# EAGLE design main (EAGLE 9.3.0)
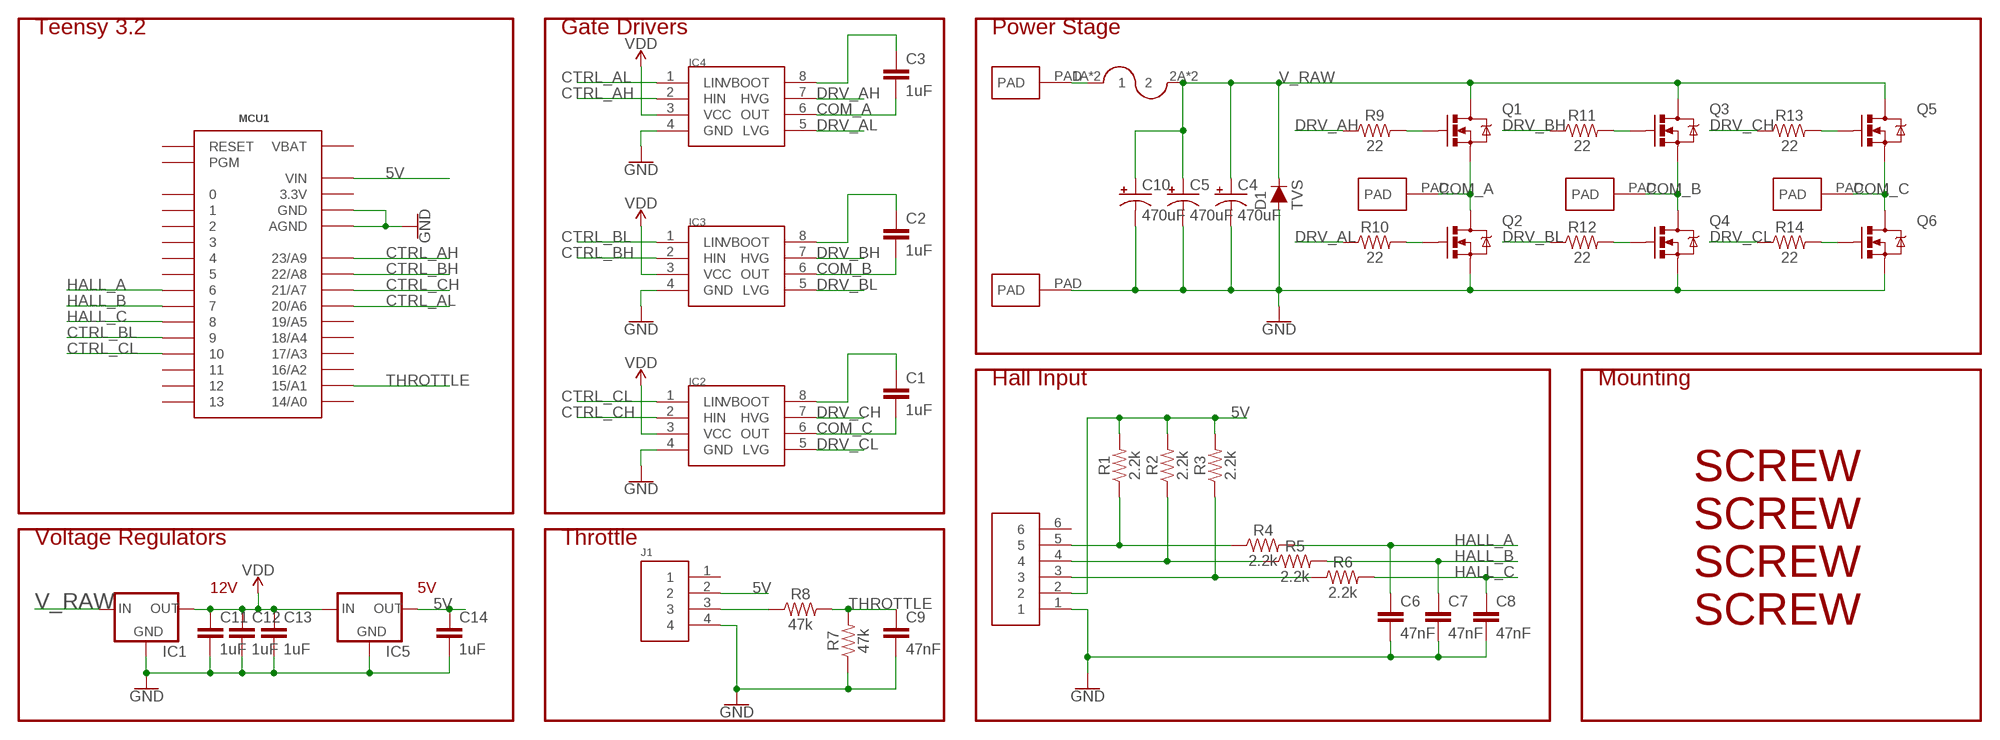
[diagram p0: schematic, sheet 1]

## Parts
C1  1uF  0.1UF-KIT-EZ-50V-20%  [CAP-PTH-SMALL-KIT]
C2  1uF  0.1UF-KIT-EZ-50V-20%  [CAP-PTH-SMALL-KIT]
C3  1uF  0.1UF-KIT-EZ-50V-20%  [CAP-PTH-SMALL-KIT]
C4  470uF  1000UF-RADIAL-5MM-25V-20%  [CPOL-RADIAL-5MM-10MM]
C5  470uF  1000UF-RADIAL-5MM-25V-20%  [CPOL-RADIAL-5MM-10MM]
C6  47nF  0.1UF-KIT-EZ-50V-20%  [CAP-PTH-SMALL-KIT]
C7  47nF  0.1UF-KIT-EZ-50V-20%  [CAP-PTH-SMALL-KIT]
C8  47nF  0.1UF-KIT-EZ-50V-20%  [CAP-PTH-SMALL-KIT]
C9  47nF  0.1UF-KIT-EZ-50V-20%  [CAP-PTH-SMALL-KIT]
C10  470uF  1000UF-RADIAL-5MM-25V-20%  [CPOL-RADIAL-5MM-10MM]
C11  1uF  0.1UF-KIT-EZ-50V-20%  [CAP-PTH-SMALL-KIT]
C12  1uF  0.1UF-KIT-EZ-50V-20%  [CAP-PTH-SMALL-KIT]
C13  1uF  0.1UF-KIT-EZ-50V-20%  [CAP-PTH-SMALL-KIT]
C14  1uF  0.1UF-KIT-EZ-50V-20%  [CAP-PTH-SMALL-KIT]
D1  TVS  DIODE-PTH  [DIODE-1N4001]
IC1  V_REG_78XX  [V78W_BACKWARDS]
IC2  L6387EDIP8  [DIP762W53P254L1092H508Q8B]
IC3  L6387EDIP8  [DIP762W53P254L1092H508Q8B]
IC4  L6387EDIP8  [DIP762W53P254L1092H508Q8B]
IC5  V_REG_78XXTO-92_UNTESTED  [TO-92]
J1  HEADER4VALULOK  [4PINVALULOK]
J2  HEADER6  [6PINVALULOK]
J3  FUSE  [AUTO_FUSE]
MCU1  TEENSY_3.0_BASIC  [TEENSY_3.0_BASIC]
Q1  MOSFET-NCHANNELTO-220-FLAT  [TO-220-FLAT]
Q2  MOSFET-NCHANNELTO-220-FLAT  [TO-220-FLAT]
Q3  MOSFET-NCHANNELTO-220-FLAT  [TO-220-FLAT]
Q4  MOSFET-NCHANNELTO-220-FLAT  [TO-220-FLAT]
Q5  MOSFET-NCHANNELTO-220-FLAT  [TO-220-FLAT]
Q6  MOSFET-NCHANNELTO-220-FLAT  [TO-220-FLAT]
R1  2.2k  RESISTORAXIAL-0.3  [AXIAL-0.3]
R2  2.2k  RESISTORAXIAL-0.3  [AXIAL-0.3]
R3  2.2k  RESISTORAXIAL-0.3  [AXIAL-0.3]
R4  2.2k  RESISTORAXIAL-0.3  [AXIAL-0.3]
R5  2.2k  RESISTORAXIAL-0.3  [AXIAL-0.3]
R6  2.2k  RESISTORAXIAL-0.3  [AXIAL-0.3]
R7  47k  RESISTORAXIAL-0.3  [AXIAL-0.3]
R8  47k  RESISTORAXIAL-0.3  [AXIAL-0.3]
R9  22  RESISTORAXIAL-0.3  [AXIAL-0.3]
R10  22  RESISTORAXIAL-0.3  [AXIAL-0.3]
R11  22  RESISTORAXIAL-0.3  [AXIAL-0.3]
R12  22  RESISTORAXIAL-0.3  [AXIAL-0.3]
R13  22  RESISTORAXIAL-0.3  [AXIAL-0.3]
R14  22  RESISTORAXIAL-0.3  [AXIAL-0.3]
U$4  PAD  [PAD]
U$5  PAD  [PAD]
U$6  PAD  [PAD]
U$7  PAD  [PAD]
U$8  PAD  [PAD]
U$10  SCREW  [M3HOLE]
U$11  SCREW  [M3HOLE]
U$12  SCREW  [M3HOLE]
U$13  SCREW  [M3HOLE]

## Nets
5V: C14.1 IC5.1(OUT) J1.2 J2.2 MCU1.VIN R1.P$2 R2.P$2 R3.P$2
COM_A: C3.2 IC4.6(OUT) Q1.3(S) Q2.2(D) Q2.PAD(D) U$6.PAD
COM_B: C2.2 IC3.6(OUT) Q3.3(S) Q4.2(D) Q4.PAD(D) U$7.PAD
COM_C: C1.2 IC2.6(OUT) Q5.3(S) Q6.2(D) Q6.PAD(D) U$8.PAD
CTRL_AH: IC4.2(HIN) MCU1.23/A9
CTRL_AL: IC4.1(LIN) MCU1.20/A6
CTRL_BH: IC3.2(HIN) MCU1.22/A8
CTRL_BL: IC3.1(LIN) MCU1.9
CTRL_CH: IC2.2(HIN) MCU1.21/A7
CTRL_CL: IC2.1(LIN) MCU1.10
DRV_AH: IC4.7(HVG) R9.P$1
DRV_AL: IC4.5(LVG) R10.P$1
DRV_BH: IC3.7(HVG) R11.P$1
DRV_BL: IC3.5(LVG) R12.P$1
DRV_CH: IC2.7(HVG) R13.P$1
DRV_CL: IC2.5(LVG) R14.P$1
GND: C4.- C5.- C6.2 C7.2 C8.2 C9.2 C10.- C11.2 C12.2 C13.2 C14.2 D1.A IC1.GND IC2.4(GND) IC3.4(GND) IC4.4(GND) IC5.2(GND) J1.4 J2.1 MCU1.AGND MCU1.GND MCU1.GND1(GND) Q2.3(S) Q4.3(S) Q6.3(S) R7.P$1 U$5.PAD
HALL_A: C6.1 MCU1.6 R4.P$2
HALL_B: C7.1 MCU1.7 R5.P$2
HALL_C: C8.1 MCU1.8 R6.P$2
N$1: C1.1 IC2.8(VBOOT)
N$2: J2.3 R3.P$1 R6.P$1
N$3: C2.1 IC3.8(VBOOT)
N$4: J2.4 R2.P$1 R5.P$1
N$5: C3.1 IC4.8(VBOOT)
N$6: J2.5 R1.P$1 R4.P$1
N$7: J1.3 R8.P$1
N$9: Q1.1(G) R9.P$2
N$10: Q2.1(G) R10.P$2
N$11: Q3.1(G) R11.P$2
N$12: Q4.1(G) R12.P$2
N$13: Q5.1(G) R13.P$2
N$14: Q6.1(G) R14.P$2
THROTTLE: C9.1 MCU1.15/A1 R7.P$2 R8.P$2
V_PREFUSE: J3.1A J3.1B U$4.PAD
V_RAW: C4.+ C5.+ C10.+ D1.C IC1.IN J3.2A J3.2B Q1.2(D) Q1.PAD(D) Q3.2(D) Q3.PAD(D) Q5.2(D) Q5.PAD(D)
VDD: C11.1 C12.1 C13.1 IC1.OUT IC2.3(VCC) IC3.3(VCC) IC4.3(VCC) IC5.3(IN)
Unconnected: J1.1 J2.6 MCU1.0 MCU1.1 MCU1.2 MCU1.3 MCU1.4 MCU1.5 MCU1.11 MCU1.12 MCU1.13 MCU1.14/A0 MCU1.16/A2 MCU1.17/A3 MCU1.18/A4 MCU1.19/A5 MCU1.PGM MCU1.RESET

## Notes on the sheet
- Teensy 3.2 | Gate Drivers | Power Stage
- Hall Input | Mounting
- Voltage Regulators | Throttle
- 12V | 5V

## Power pins joined to a net without a drawn wire
3.3V: MCU1.3.3V MCU1.3.3V1(3.3V)
VBAT: MCU1.VBAT

## Library data of the parts
C1-C3 C6-C9 C11-C14 = SparkFun-Capacitors:0.1UF: 0.1µF ceramic capacitors A capacitor is a passive two-terminal electrical component used to store electrical energy temporarily in an electric field.; PROD_ID: CAP-08370; VALUE: 0.1uF
C4 C5 C10 = SparkFun-Capacitors:1000UF: 1,000µF/1mF ceramic capacitors A capacitor is a passive two-terminal electrical component used to store electrical energy temporarily in an electric field. CAP-08070; PROD_ID: CAP-09538; VALUE: 1mF
D1 = SparkFun-DiscreteSemi:DIODE: Diode These are standard reverse protection diodes and small signal diodes. SparkFun Products: SparkFun SparkPunk Sound Kit <https://www.sparkfun.com/products/11177> SparkFun ESP8266 Thing <https://www.sparkfun.com/products/13231>; PROD_ID: DIO-09176; VALUE: 1A/50V/1.1V
IC1 = 2018:V_REG_78XX: Voltage Regulator Standard 7805 5V regulator. IGO (Input Ground Output). Spark Fun Electronics SKU : COM-00107
IC2-IC4 = Custom_old:L6387E
IC5 = SparkFun-IC-Power:V_REG_78XX: Voltage Regulator Standard 78xx regulator. IGO (Input Ground Output). Spark Fun Electronics SKU : COM-00107
J1 = Custom_old:HEADER4
J2 = Custom_old:HEADER6
J3 = Custom_old:FUSE
MCU1 = Teensy3.0:TEENSY_3.0_BASIC: Basic Teensy 3.0 with none of the 'inner' pins enabled. See '+4', 'AllAnalogPins", and 'AllPins' packages for additional pin holes, as needed.
Q1-Q6 = Custom_old:MOSFET-NCHANNEL: Generic NMOS footprint
R1-R14 = SparkFun-Resistors:RESISTOR: Generic Resistor Package
U$4-U$8 = Custom_old:PAD
U$10-U$13 = Custom_old:SCREW

## Board
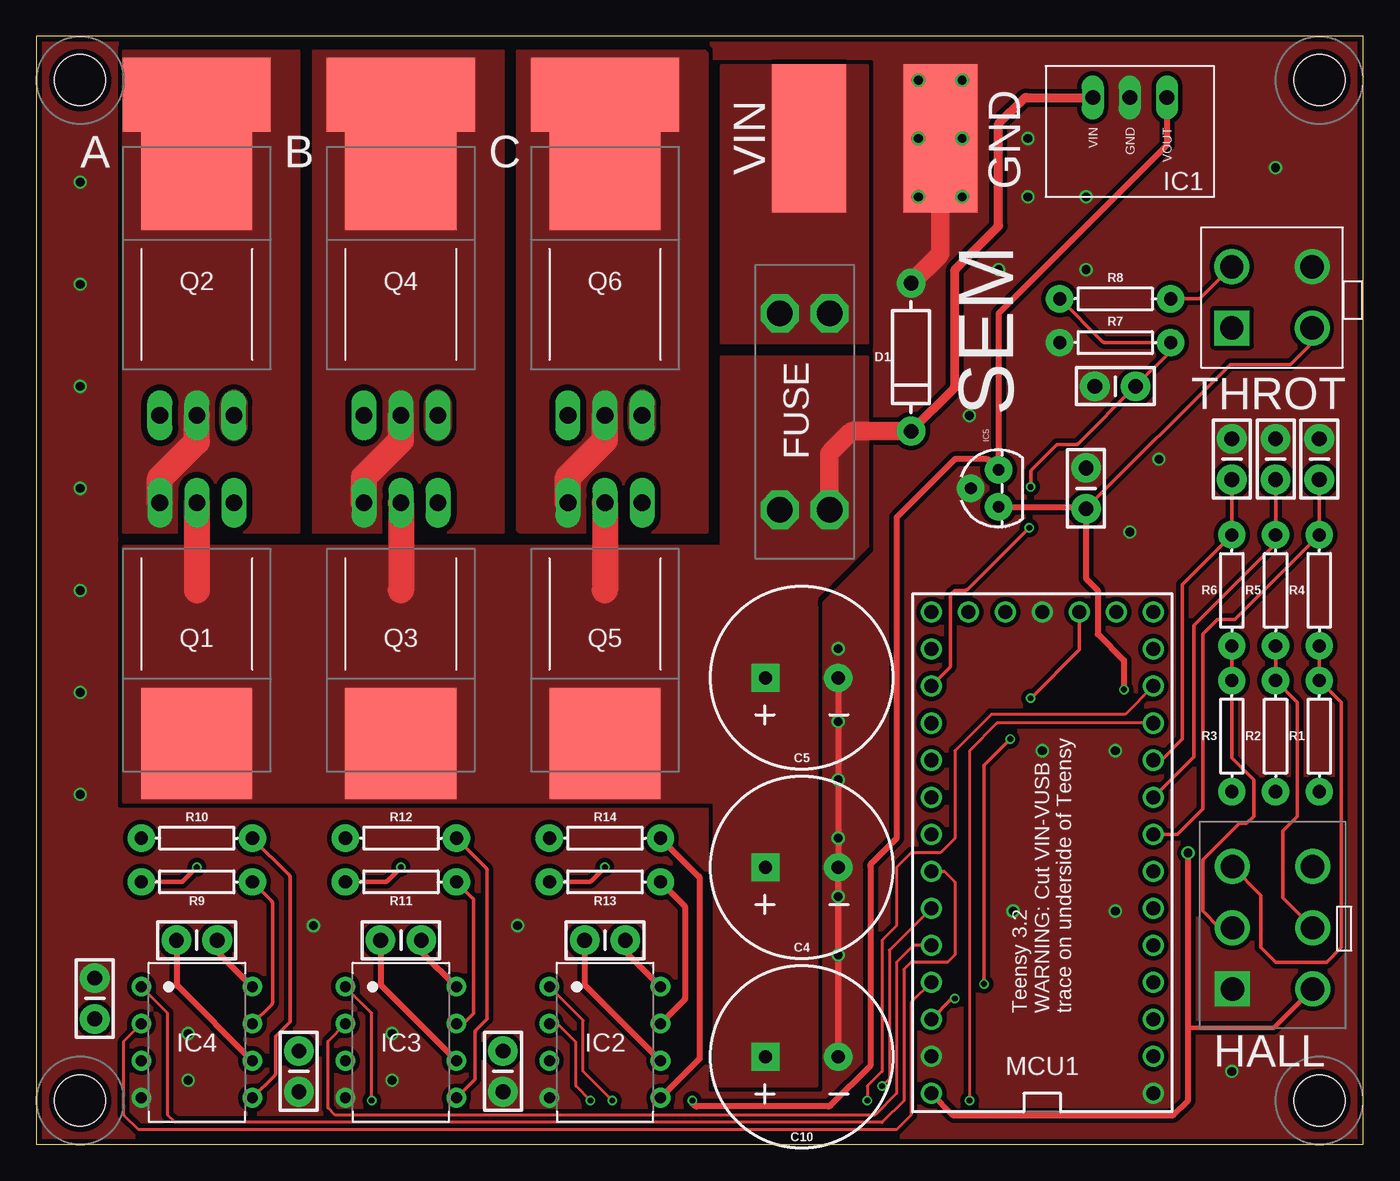
[diagram p1: board, top side]
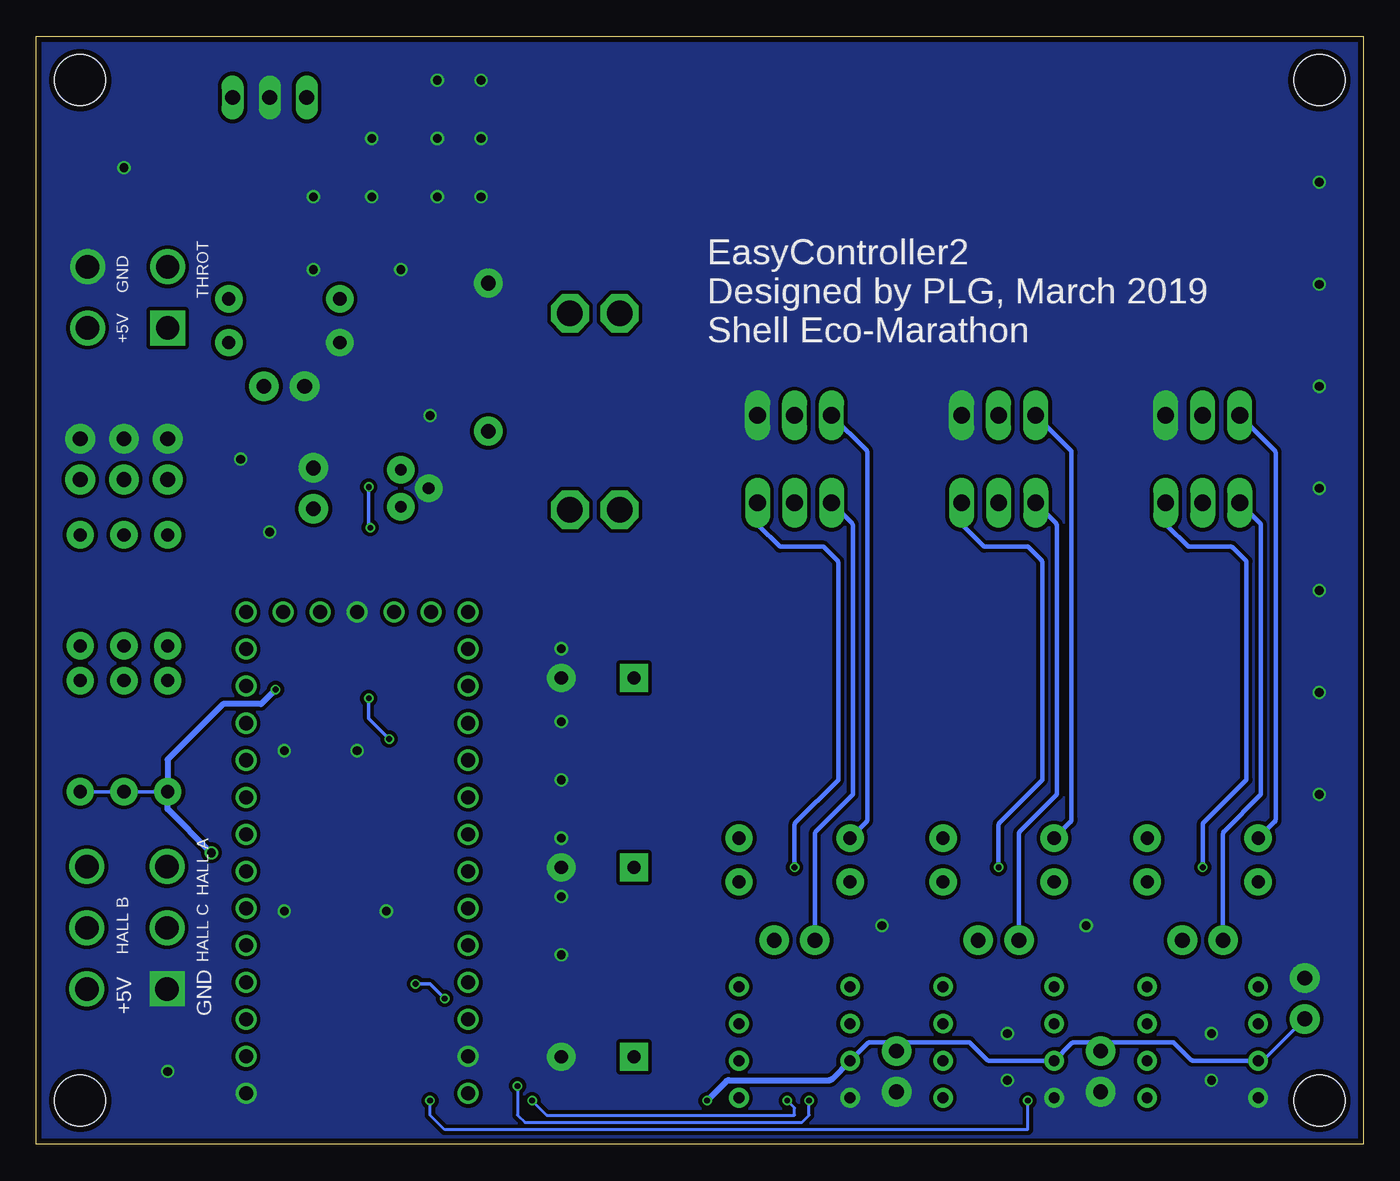
[diagram p2: board, bottom side, seen from below]

Size 91 x 76 mm. Coordinates in mm from the lower left corner, seen from the top.
Outline: 0,0 91,0 91,76 0,76 0,0
Copper layers (1*16): Top 0.035559375mm / dielectric 1.6mm / Bottom 0.035559375mm
Design rules "PATRICK-2lyr *": minimum track width 6mil, minimum drill 10mil, track to track 6mil, track to pad 6mil, pad to pad 6mil, via to via 6mil, smd to smd 6mil, copper to edge 15mil, drill to drill 6mil, minimum pad ring 5mil, minimum via ring 5mil, stop-mask expansion 2.5mil, vias tented up to drill 25mil, thermal gap 10mil

### Footprints (pad centres in the part's own frame; a part is rotated, then mirrored left to right if it is on the bottom)
CAP-PTH-SMALL-KIT = drill 1.016 pad 2.032: 1 -1.397,0; 2 1.397,0
CPOL-RADIAL-5MM-10MM = drill 0.9 pad 1.93 square: + 2.5,0 | drill 0.9 pad 1.93: - -2.5,0
DIODE-1N4001 = drill 1 pad 1.981: A -5.08,0; C 5.08,0
V78W_BACKWARDS = drill 1.016 long: GND 0,-3.81; IN 2.54,-3.81; OUT -2.54,-3.81
DIP762W53P254L1092H508Q8B = drill 0.743 pad 1.343: 1 -3.81,3.81; 2 -3.81,1.27; 3 -3.81,-1.27; 4 -3.81,-3.81; 5 3.81,-3.81; 6 3.81,-1.27; 7 3.81,1.27; 8 3.81,3.81
TO-92 = drill 0.813 pad 1.88: 1 -1.27,0; 2 0,1.905; 3 1.27,0
4PINVALULOK = drill 1.6 square: 1 0,5.5 | drill 1.6: 2 0,0; 3 4.2,5.5; 4 4.2,0
6PINVALULOK = drill 1.6 square: 1 -6.35,2.96 | drill 1.6: 2 -6.35,-2.54; 3 -2.15,2.96; 4 -2.15,-2.54; 5 2.05,2.96; 6 2.05,-2.54
AUTO_FUSE = drill 1.75 octagon: 1A 0,3.4; 1B 0,0; 2A 13.47,3.4; 2B 13.47,0
TEENSY_3.0_BASIC = drill 0.965: 0 -7.62,13.97; 1 -7.62,11.43; 2 -7.62,8.89; 3 -7.62,6.35; 3.3V 7.62,11.43; 3.3V1 -2.54,-16.51; 4 -7.62,3.81; 5 -7.62,1.27; 6 -7.62,-1.27; 7 -7.62,-3.81; 8 -7.62,-6.35; 9 -7.62,-8.89; 10 -7.62,-11.43; 11 -7.62,-13.97; 12 -7.62,-16.51; 13 7.62,-16.51; 14/A0 7.62,-13.97; 15/A1 7.62,-11.43; 16/A2 7.62,-8.89; 17/A3 7.62,-6.35; 18/A4 7.62,-3.81; 19/A5 7.62,-1.27; 20/A6 7.62,1.27; 21/A7 7.62,3.81; 22/A8 7.62,6.35; 23/A9 7.62,8.89; AGND 7.62,13.97; GND -7.62,16.51; GND1 0,-16.51; PGM 2.54,-16.51; RESET 5.08,-16.51; VBAT -5.08,-16.51; VIN 7.62,16.51
TO-220-FLAT = drill 1.143 long: 1 -2.54,0; 2 0,0; 3 2.54,0 | smd 7.62 x 7.62: PAD 0,16.51
AXIAL-0.3 = drill 0.9 pad 1.88: P$1 -3.81,0; P$2 3.81,0
PAD = smd 10.16 x 5.08: PAD 0,0
M3HOLE = hole 3.5: 0,0

### Placement (x,y rotation side)
C1  39,14 180 top
C2  25,14 180 top
C3  11,14 180 top
C4  52.5,19 180 top
C5  52.5,32 180 top
C6  88,47 90 top
C7  85,47 90 top
C8  82,47 90 top
C9  74,52 180 top
C10  52.5,6 180 top
C11  4,10 90 top
C12  32,5 270 top
C13  18,5 270 top
C14  72,45 90 top
D1  60,54 270 top
IC1  75,68 180 top
IC2  39,7 0 top
IC3  25,7 0 top
IC4  11,7 0 top
IC5  66,45 90 top
J1  87.5,56 90 top
J2  85,17 90 top
J3  51,57 270 top
MCU1  69,20 180 top
Q1  11,44 180 top
Q2  11,50 0 top
Q3  25,44 180 top
Q4  25,50 0 top
Q5  39,44 180 top
Q6  39,50 0 top
R1  88,28 270 top
R2  85,28 270 top
R3  82,28 270 top
R4  88,38 90 top
R5  85,38 90 top
R6  82,38 90 top
R7  74,55 0 top
R8  74,58 180 top
R9  11,18 180 top
R10  11,21 180 top
R11  25,18 180 top
R12  25,21 180 top
R13  39,18 180 top
R14  39,21 180 top
U$4  53,69 90 top
U$5  62,69 270 top
U$6  11,72 0 top
U$7  25,72 0 top
U$8  39,72 0 top
U$10  88,73 0 top
U$11  88,3 0 top
U$12  3,3 0 top
U$13  3,73 0 top

### Tracks (layer width: path | path; a pad name or v marks a point on that pad's centre or on a via)
3.3V  (via drill 0.4)
  Top 0.254: MCU1.3.3V 62.81,10 v63,10 | v65,11 65,26 v66.8,27.8 | v68.2,30.6 71.54,33.94 MCU1.3.3V1
  Bottom 0.254: v63,10 64,11 v65,11 | v66.8,27.8 68.2,29.2 v68.2,30.6
5V  (via drill 0.4, 0.6)
  Top 0.254: C14.1 81.9,53.5 86,53.5 87.5,55 J1.2
  Top 0.305: J2.2 84.89,8 79,8
  Top 0.406: IC5.1 71.87,43.73 C14.1 72,38.8 72.8,38 72.8,35 74.6,33.2 v74.6,31.2 | MCU1.VIN 62.87,2 78,2 79,3 79,8 v79,20
  Bottom 0.254: R1.P$2 R2.P$2 R3.P$2
  Bottom 0.406: v79,20 82,23 R3.P$2 82,26.4 78.2,30.2 75.6,30.2 v74.6,31.2
COM_A
  Top 0.406: C3.2 9.6,11.04 arc45 9.68,10.86 IC4.6
  Top 1.8: Q1.3 8.46,45.55 arc-45 8.53,45.73 11,48.2 Q2.2
  Bottom 0.305: Q1.3 7.07,42.61 arc45 7,42.44 7,24 9.53,21.47 arc-45 9.6,21.29 C3.2
  pour Top (isolate 0.406, no thermals): 6,75 6,42 18,42 18,75
COM_B
  Top 0.406: C2.2 23.6,11.04 arc45 23.68,10.86 IC3.6
  Top 1.8: Q3.3 22.46,45.66 arc-45 22.53,45.83 25,48.3 Q4.2
  Bottom 0.305: C2.2 23.6,21.29 arc45 23.53,21.47 21,24 21,42.44 arc-45 21.07,42.61 Q3.3
  pour Top (isolate 0.406, rank 2, no thermals): 19,75 19,42 32,42 32,75
COM_C
  Top 0.406: C1.2 37.6,11.04 arc45 37.68,10.86 IC2.6
  Top 1.8: Q5.3 36.46,45.66 arc-45 36.53,45.83 39,48.3 Q6.2
  Bottom 0.305: C1.2 37.6,21.29 arc45 37.53,21.47 35,24 35,42.44 arc-45 35.07,42.61 Q5.3
  pour Top (isolate 0.406, rank 3, no thermals): 33,75 33,42.25 arc90 33.25,42 46,42 46,74.75 arc90 45.75,75
CTRL_AH
  Top 0.203: MCU1.23/A9 60,9.73 60,2 59,1 7,1 6,2 6,7.08 IC4.2
CTRL_AL
  Top 0.203: MCU1.20/A6 62.27,18.73 63,18 63,13 62.5,12.5 60,12.5 59.5,12 59.5,3 58,1.5 9.5,1.5 9,2 9,9 IC4.1
CTRL_BH
  Top 0.203: MCU1.22/A8 60.15,13.65 59,12.5 59,3.5 57.5,2 20.5,2 20,2.5 20,7.08 IC3.2
CTRL_BL  (via drill 0.4)
  Top 0.203: MCU1.9 65.89,28.89 64,27 v64,3 | v23,3 23,9 IC3.1
  Bottom 0.203: v23,3 23,1 63,1 64,2 v64,3
CTRL_CH  (via drill 0.4)
  Top 0.203: MCU1.21/A7 58.5,13.31 58.5,4.5 v58,4 | v38,3 37,4 37,7 35.73,8.27 IC2.2
  Bottom 0.203: v58,4 58,2 57.5,1.5 38.5,1.5 38,2 v38,3
CTRL_CL  (via drill 0.4)
  Top 0.203: MCU1.10 74.69,29.5 65.5,29.5 63,27 63,21 62,20 60,20 59,19 59,15 58,14 58,5 57,4 v57,3 | v39.5,3 37.5,5 37.5,8.5 IC2.1
  Bottom 0.203: v57,3 56,2 39,2 39,2.5 v39.5,3
DRV_AH
  Top 0.254: IC4.7 16.13,9.59 arc45 16.2,9.77 16.2,16.5 arc45 16.13,16.68 R9.P$1
DRV_AL
  Top 0.254: IC4.5 16.33,4.71 arc45 16.4,4.88 16.4,7.29 arc-45 16.47,7.47 17.4,8.4 17.4,18.3 arc45 17.33,18.48 R10.P$1
DRV_BH
  Top 0.254: R11.P$1 29.93,16.88 arc-45 30,16.7 30,9 29.34,8.34 arc-45 29.16,8.27 IC3.7
DRV_BL
  Top 0.254: IC3.5 30.03,4.41 arc45 30.1,4.58 30.1,7.7 arc-45 30.17,7.87 30.9,8.6 30.9,18.8 arc45 30.83,18.98 R12.P$1
DRV_CH
  Top 0.406: R13.P$1 44.43,16.38 arc-45 44.5,16.2 44.5,10.06 arc-45 44.43,9.89 IC2.7
DRV_CL
  Top 0.406: IC2.5 45.43,5.81 arc45 45.5,5.99 45.5,18.2 arc45 45.43,18.38 R14.P$1
GND  (via drill 0.6)
  Top 0.406: C5.- C4.- C10.-
  Top 1.27: D1.A 61.93,61.01 arc45 62,61.19 U$5.PAD
  other vias: 3,66 3,59 3,52 3,45 3,38 3,31 3,24 60.5,73 60.5,69 60.5,65 63.5,65 63.5,69 63.5,73 68,69 68,65 72,65 72,60 66,60 69,27 74,27 67,16 74,16 82,5 55,34 55,29 55,25 55,21 55,17 55,13 85,67 19,15 33,15 75,42 64,50 77,47 10.4,7.6 10.4,4.4 24.4,7.6 24.4,4.4
  pour Bottom (isolate 0.254, rank 5, no thermals): -2,78 -2,-2 92,-2 92,78
  pour Top (isolate 0.305, rank 5, no thermals): -1,77 -1,-0.75 arc90 -0.75,-1 91,-1 91,76.75 arc90 90.75,77
HALL_A
  Top 0.254: C6.1 R4.P$2 82.19,36 81,36 80,35 80,23 78.27,21.27 MCU1.6
HALL_B
  Top 0.254: C7.1 85,42 R5.P$2 85,41.2 79.4,35.6 79.4,26.59 MCU1.7
HALL_C
  Top 0.254: C8.1 R6.P$2 78.6,38.41 78.6,27.8 77.15,26.35 MCU1.8
N$1
  Top 0.406: C1.1 40.4,13.33 arc45 40.47,13.15 IC2.8
N$2
  Top 0.254: R6.P$1 R3.P$1 82,26.5 83.5,25 83.5,22.5 83,22 82.5,22 80,19.5 80,16 81.15,14.85 J2.3
N$3
  Top 0.406: C2.1 26.4,13.33 arc45 26.47,13.15 IC3.8
N$4
  Top 0.254: R5.P$1 R2.P$1 86.5,30.31 86.5,22.5 85.5,21.5 85.5,16.89 J2.4
N$5
  Top 0.406: C3.1 12.4,13.33 arc45 12.47,13.15 IC4.8
N$6
  Top 0.254: R4.P$1 R1.P$1 89.5,30.31 89.5,13.5 88.5,12.5 85,12.5 84,13.5 84,17.09 J2.5
N$7
  Top 0.254: J1.3 79.8,58 R8.P$1
N$9  (via drill 0.4)
  Top 0.305: R9.P$2 9.89,18 arc45 10.07,18.07 v11,19
  Bottom 0.305: v11,19 11,21.89 arc45 10.93,22.07 8,25 8,40 8.93,40.93 arc-45 9.11,41 12,41 13.47,42.47 arc45 13.54,42.65 Q1.1
N$10
  Bottom 0.305: R10.P$2 6.07,22.12 arc-45 6,22.3 6,47.44 arc-45 6.07,47.61 Q2.1
N$11  (via drill 0.4)
  Top 0.305: R11.P$2 23.89,18 arc45 24.07,18.07 v25,19
  Bottom 0.305: v25,19 25,21.89 arc45 24.93,22.07 22,25 22,39.9 arc-45 22.07,40.07 23,41 26,41 27.47,42.47 arc45 27.54,42.65 Q3.1
N$12
  Bottom 0.305: R12.P$2 20.07,22.12 arc-45 20,22.3 20,47.44 arc-45 20.07,47.61 Q4.1
N$13  (via drill 0.4)
  Top 0.305: R13.P$2 37.9,18 arc45 38.07,18.07 v39,19
  Bottom 0.305: v39,19 39,21.89 arc45 38.93,22.07 36,25 36,39.9 arc-45 36.07,40.07 37,41 40,41 41.47,42.47 arc45 41.54,42.65 Q5.1
N$14
  Bottom 0.305: R14.P$2 34.07,22.12 arc-45 34,22.3 34,47.44 arc-45 34.07,47.61 Q6.1
THROTTLE  (via drill 0.4)
  Top 0.254: R8.P$2 73.12,55.07 arc45 73.3,55 R7.P$2 77.81,54.52 arc-45 77.74,54.34 C9.1 71.47,48.07 arc-45 71.29,48 70,48 68.27,46.27 arc45 68.2,46.09 v68.2,45.1 | v68.1,42.3 63.87,38.07 arc-45 63.7,38 63,38 62.77,37.77 arc45 62.7,37.59 62.7,32.85 arc-45 62.63,32.68 MCU1.15/A1
  Bottom 0.254: v68.2,45.1 68.2,42.3 v68.1,42.3
V_PREFUSE
  pour Top (isolate 0.254, no thermals): 47,74 47,55 57,55 57,74
V_RAW
  Top 0.61: D1.C 62.93,51.85 arc45 63,52.02 63,59.9 arc-45 63.07,60.07 66,63 66,70 67.74,71.74 arc-45 67.92,71.81 IC1.IN
  Top 1.27: D1.C 56.02,48.92 arc45 55.85,48.85 54.47,47.47 arc45 54.4,47.3 J3.2A
  Top 1.8: Q1.2 11,38 | Q3.2 25,38 | Q5.2 39,38
  pour Top (isolate 0.254, no thermals): 6,41 6,23.5 46.5,23.5 46.5,4 53.5,4 53.5,36.89 arc-45 53.57,37.57 57,41 57,54 47,54 47,41
VDD  (via drill 0.4)
  Top 0.406: IC1.OUT 77.54,68.54 66,57 IC5.3 65.34,46.93 arc45 65.17,47 63,47 59.07,43.07 arc45 59,42.9 59,21 57.27,19.27 arc45 57.2,19.09 57.2,5.4 54.47,2.67 arc-45 54.3,2.6 45.3,2.6 arc-45 45.13,2.67 45,2.8 v45,3
  Bottom 0.254: C13.1 18,7 | C12.1 32,7 | C11.1 6.8,5.8 arc45 6.98,5.73 IC4.3
  Bottom 0.305: IC4.3 11.62,5.73 arc45 11.8,5.8 13,7 18,7 19.82,7 arc-45 19.99,6.93 IC3.3 25.62,5.73 arc45 25.8,5.8 27,7 32,7 33.81,7 arc-45 33.99,6.93 35.16,5.76 IC2.3
  Bottom 0.406: v45,3 43.67,4.33 arc45 43.49,4.4 36.62,4.4 arc-45 36.45,4.47 35.16,5.76

### Text on the board
tPlace: A | B | C | VIN | GND | SEM | THROT | FUSE | Teensy 3.2 / WARNING: Cut VIN-VUSB / trace on underside of Teensy | HALL
bPlace: THROT | GND | +5V | EasyController2 / Designed by PLG, March 2019 / Shell Eco-Marathon | HALL A | HALL B | HALL C | GND | +5V